# EAGLE schematic Controller (EAGLE 7.1.0)
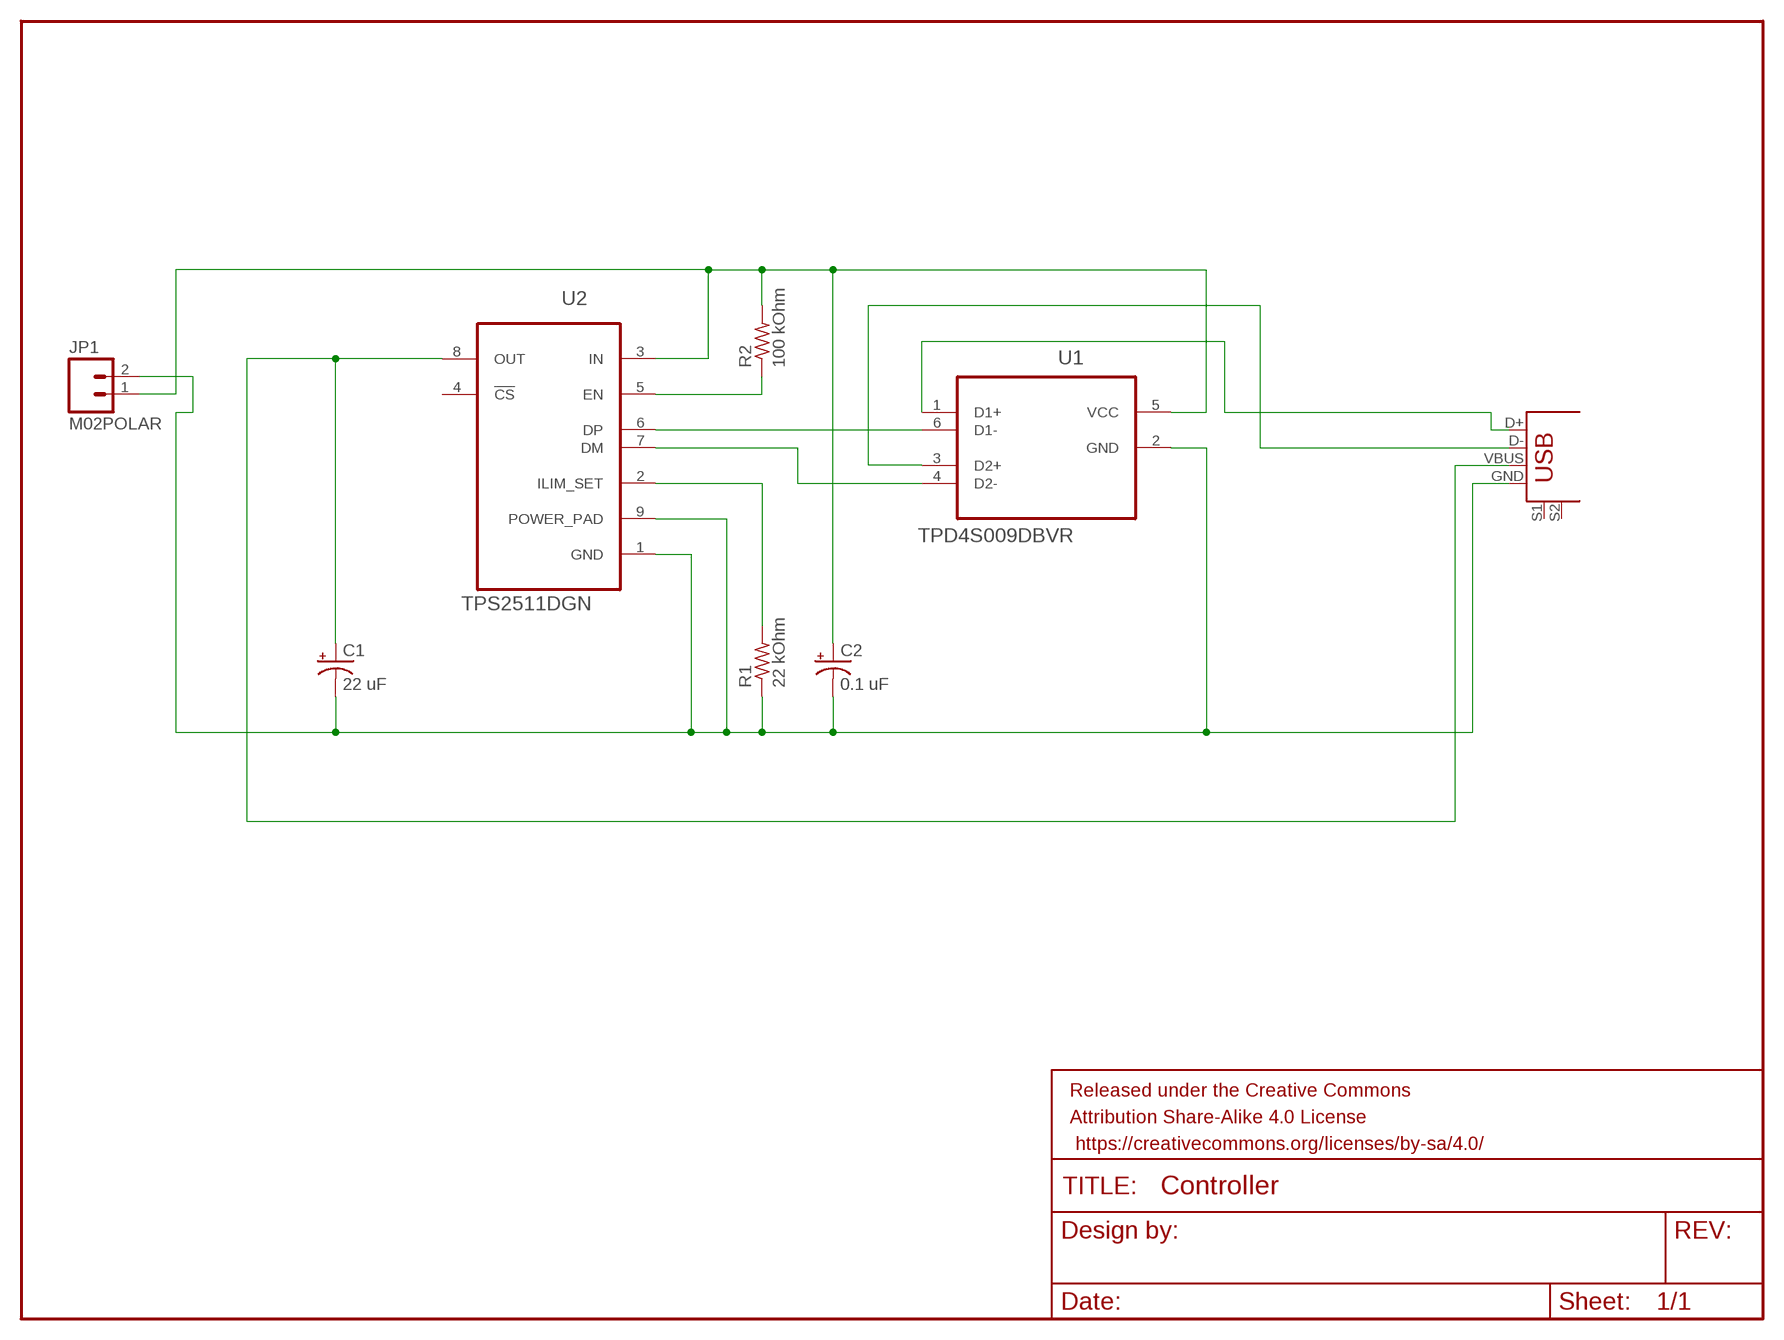
[diagram p0: schematic, sheet 1]

## Parts
C1  22 uF  CPOL-USE2.5-5  [E2,5-5]
C2  0.1 uF  CPOL-USE2.5-5  [E2,5-5]
FRAME1  FRAME-LETTER  [CREATIVE_COMMONS]
JP1  M02POLAR  [MOLEX-1X2]
R1  22 kOhm  R-US_0207/10  [0207/10]
R2  100 kOhm  R-US_0207/10  [0207/10]
U1  TPD4S009DBVR  [SOT95P280X145-6N]
U2  TPS2511DGN  [SOP65P490X110-9N]
U$2  USB+SHIELDUSB-A-S-NOSILK-FEMALE  [USB-A-S-NOSILK-FEMALE]

## Nets
N$1: R2.1 U2.5(EN)
N$3: C2.+ JP1.1 R2.2 U1.5(VCC) U2.3(IN)
N$4: U1.6(D1-) U2.6(DP)
N$5: U1.4(D2-) U2.7(DM)
N$6: R1.2 U2.2(ILIM_SET)
N$7: C1.- C2.- JP1.2 R1.1 U1.2(GND) U2.1(GND) U2.9(POWER_PAD) U$2.GND
N$8: U1.1(D1+) U$2.D+
N$9: U1.3(D2+) U$2.D-
N$12: C1.+ U2.8(OUT) U$2.VBUS
Unconnected: U2.4(!CS) U$2.S1 U$2.S2

## Library data of the parts
C1 C2 = adafruit:CPOL-US: POLARIZED CAPACITOR, American symbol
FRAME1 = SparkFun-Aesthetics:FRAME-LETTER: Schematic Frame Standard 8.5x11 US Letter frame
JP1 = SparkFun-Connectors:M02: Standard 2-pin 0.1" header. Use with - straight break away headers ( PRT-00116) - right angle break away headers (PRT-00553) - swiss pins (PRT-00743) - machine pins (PRT-00117) - female headers (PRT-00115) Molex polarized connector foot print use with: PRT-08233 with associated crimp pins and housings. 2.54_SCREWTERM for use with PRT-10571. 3.5mm Screw Terminal footprints for PRT-08084 5mm Screw Terminal footprints for use with PRT-08432
R1 R2 = adafruit:R-US_: RESISTOR, American symbol
U1 = Texas Instruments_By_element14_Batch_1:TPD4S009DBVR: 4-CHANNEL ESD SOLUTION FOR HIGH-SPEED DIFFERENTIAL INTERFACE; MPN: TPD4S009DBVR; OC_FARNELL: 1855143; OC_NEWARK: 33R2191; PACKAGE: SOT-23-6; SUPPLIER: TEXAS INSTRUMENTS
U2 = TI-TPS2511DGN:TPS2511DGN: USB Dedicated Charging Port Controller,MSOP-8; MPN: TPS2511DGN; OC_FARNELL: 2211372; OC_NEWARK: 44W8612; PACKAGE: MSOP-8; SUPPLIER: TEXAS INSTRUMENTS
U$2 = SparkFun-Connectors:USB+SHIELD: USB+Shield USB connector with shield pins connectable